# EAGLE design 5vBuckV2 (EAGLE 7.6.0)
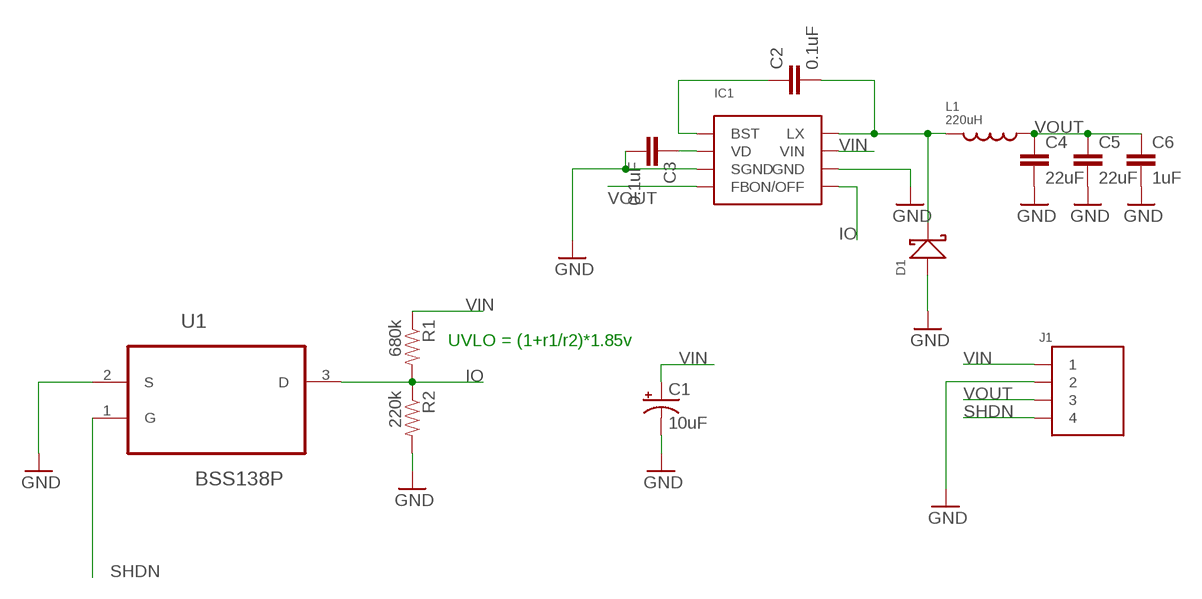
[diagram p0: schematic, sheet 1]

## Parts
C1  10uF  CAP_POLF80  [NIPPON_F80]
C2  0.1uF  0.33UF-50V-10%(0805)  [0805-CAP]
C3  0.1uF  0.33UF-50V-10%(0805)  [0805-CAP]
C4  22uF  0.33UF-50V-10%(0805)  [0805-CAP]
C5  22uF  0.33UF-50V-10%(0805)  [0805-CAP]
C6  1uF  0.33UF-50V-10%(0805)  [0805-CAP]
D1  DIODE_SCHOTTKYSOD-123  [SOD-123]
IC1  M5033  [SOIC-8]
J1  CONNECTOR_4PIN  [4PIN_.1']
L1  220uH  CHIP_IND1  [6X6MM_IND]
R1  680k  0.22OHM-1/4W-1%(0805)  [0805]
R2  220k  0.22OHM-1/4W-1%(0805)  [0805]
U1  BSS138P  [SOT95P230X110-3N]

## Nets
GND: C1.- C3.2 C4.2 C5.2 C6.2 D1.ANODE IC1.P$3(SGND) IC1.P$6(GND) J1.P$2 R2.2 U1.2(S)
IO: IC1.P$5(ON/OFF) R1.2 R2.1 U1.3(D)
N$1: C2.2 D1.CATHODE IC1.P$8(LX) L1.P$1
N$2: C2.1 IC1.P$1(BST)
N$5: C3.1 IC1.P$2(VD)
SHDN: J1.P$4 U1.1(G)
VIN: C1.+ IC1.P$7(VIN) J1.P$1 R1.1
VOUT: C4.1 C5.1 C6.1 IC1.P$4(FB) J1.P$3 L1.P$2

## Notes on the sheet
- UVLO = (1+r1/r2)*1.85v

## Library data of the parts
C1 = SparkFun-Capacitors:CAP_POL: Capacitor Polarized These are standard SMD and PTH capacitors. Normally 10uF, 47uF, and 100uF in electrolytic and tantalum varieties. Always verify the external diameter of the through hole cap, it varies with capacity, voltage, and manufacturer. The EIA devices should be standard.
C2-C6 = SparkFun-Capacitors:0.33UF-50V-10%(0805): CAP-08469; PROD_ID: CAP-08469; VALUE: 0.33uF
D1 = lolomolo:DIODE_SCHOTTKY
IC1 = lolomolo:M5033
J1 = lolomolo:CONNECTOR_4PIN
L1 = lolomolo:CHIP_IND: Chip Inductor
R1 R2 = SparkFun-Resistors:0.22OHM-1/4W-1%(0805): RES-09883; PROD_ID: RES-09883; VALUE: 0.22
U1 = NXP_By_element14_Batch_1:BSS138P: MOSFET; MPN: BSS138P; OC_FARNELL: 1859849; OC_NEWARK: 27T2631; PACKAGE: SOT-23-3; SUPPLIER: NXP

## Board
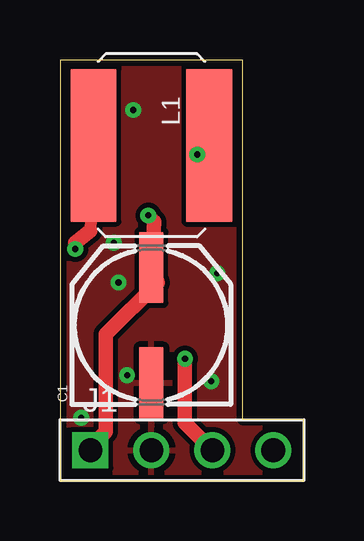
[diagram p1: board, top side]
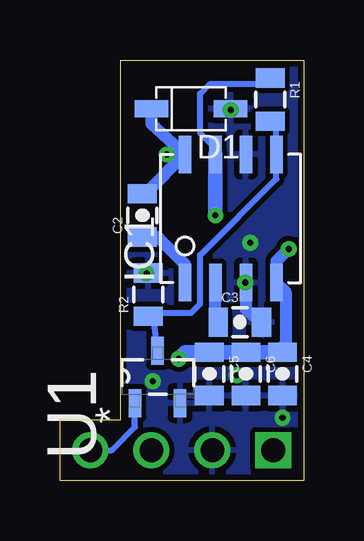
[diagram p2: board, bottom side, seen from below]

Size 10.16 x 17.53 mm. Coordinates in mm from the lower left corner, seen from the top.
Outline: 0,0 10.16,0 10.16,2.54 7.62,2.54 7.62,17.53 0,17.53 0,0
Copper layers (1*16): Top 0.035mm / dielectric 1.5mm / Bottom 0.035mm
Design rules "default *": minimum track width 10mil, minimum drill 10mil, track to track 8mil, track to pad 8mil, pad to pad 8mil, via to via 8mil, smd to smd 8mil, copper to edge 10mil, drill to drill 8mil, minimum pad ring 10mil, minimum via ring 8mil, stop-mask expansion 4mil, vias tented up to drill 0mil, thermal gap 10mil

### Footprints (pad centres in the part's own frame; a part is rotated, then mirrored left to right if it is on the bottom)
NIPPON_F80 = smd 2.95 x 1: + 2.4,0; - -2.4,0
0805-CAP = smd 0.8 x 1.2: 1 -0.9,0; 2 0.9,0
SOD-123 = smd 1.4 x 0.7: ANODE 0,0; CATHODE 3.3,0
SOIC-8 = smd 1.575 x 0.508: P$1 0,3.81; P$2 0,2.54; P$3 0,1.27; P$4 0,0; P$5 5.334,0; P$6 5.334,1.27; P$7 5.334,2.54; P$8 5.334,3.81
4PIN_.1' = drill 0.991 square: P$1 -3.81,0 | drill 0.991: P$2 -1.27,0; P$3 1.27,0; P$4 3.81,0
6X6MM_IND = smd 1.905 x 6.35: P$1 -2.413,0; P$2 2.413,0
0805 = smd 0.8 x 1.2: 1 -0.9,0; 2 0.9,0
SOT95P230X110-3N = smd 1.168 x 0.533: 1 -1.092,0.94; 2 -1.092,-0.94; 3 1.092,0

### Placement (x,y rotation side)
C1  3.81,6.48 90 top
C2  6.73,11.05 90 bottom
C3  2.67,6.6 0 bottom
C4  0.89,4.45 270 bottom
C5  3.94,4.45 270 bottom
C6  2.41,4.45 270 bottom
D1  3.05,15.49 180 bottom
IC1  1.14,8.26 90 bottom
J1  5.08,1.27 0 top
L1  3.81,13.97 180 top
R1  1.4,15.88 270 bottom
R2  6.48,7.75 90 bottom
U1  6.1,4.32 90 bottom

### Tracks (layer width: path | path; a pad name or v marks a point on that pad's centre or on a via)
GND  (via drill 0.25)
  Bottom 0.508: IC1.P$3 2.41,7.12 C3.2
  other vias: 2.44,8.26 2.24,9.91 2.79,4.39 6.55,8.64 6.3,4.14 3.05,15.44 0.89,2.62
  pour Bottom: 0,0 10.16,0 10.16,2.54 7.62,2.54 7.62,17.53 0,17.53
  pour Top: 0,0 10.16,0 10.16,2.54 7.62,2.54 7.62,17.53 0,17.53
IO
  Bottom 0.254: U1.3 6.22,6.55 R2.1 6.72,6.99 4.7,6.99 4.32,7.37 4.32,9.4 1.14,12.57 IC1.P$5 1.14,14.72 R1.2
N$1  (via drill 0.25)
  Top 0.254: v5.71,13.59 5.97,13.59 L1.P$1
  Top 0.508: L1.P$1 v5.71,13.59
  Bottom 0.254: IC1.P$8 v5.71,13.59
  Bottom 0.508: D1.CATHODE 6.35,14.86 IC1.P$8 6.59,11.95 C2.2
N$2
  Bottom 0.508: IC1.P$1 4.95,9.02 6.08,10.15 C2.1
N$5
  Bottom 0.508: C3.1 3.68,7 IC1.P$2
SHDN
  Bottom 0.254: J1.P$4 8,1.27 7.04,2.23 U1.1
VIN  (via drill 0.25)
  Top 0.61: v3.68,11.05 3.94,10.79 C1.+ 4.06,8.26 1.91,6.1 1.91,2.03 1.27,1.4 J1.P$1
  Bottom 0.254: R1.1 1.65,16.51 3.94,16.51 4.32,16.13 4.32,14.48 3.68,13.84 IC1.P$7
  Bottom 0.61: v3.68,11.05 IC1.P$7
VOUT  (via drill 0.25)
  Top 0.508: L1.P$2 1.27,10.41
  Top 0.61: v0.64,9.65 0.64,9.91 1.27,10.41 | v5.21,5.08 5.21,2.41 J1.P$3
  Bottom 0.508: C4.1 1.13,5.34 0.76,5.71 0.76,7.87 IC1.P$4 1.14,9.14 v0.64,9.65
  Bottom 0.61: C4.1 C6.1 C5.1 4.94,5.34 v5.21,5.08